# Altium schematic sheet iSensor.SchDoc
size A4
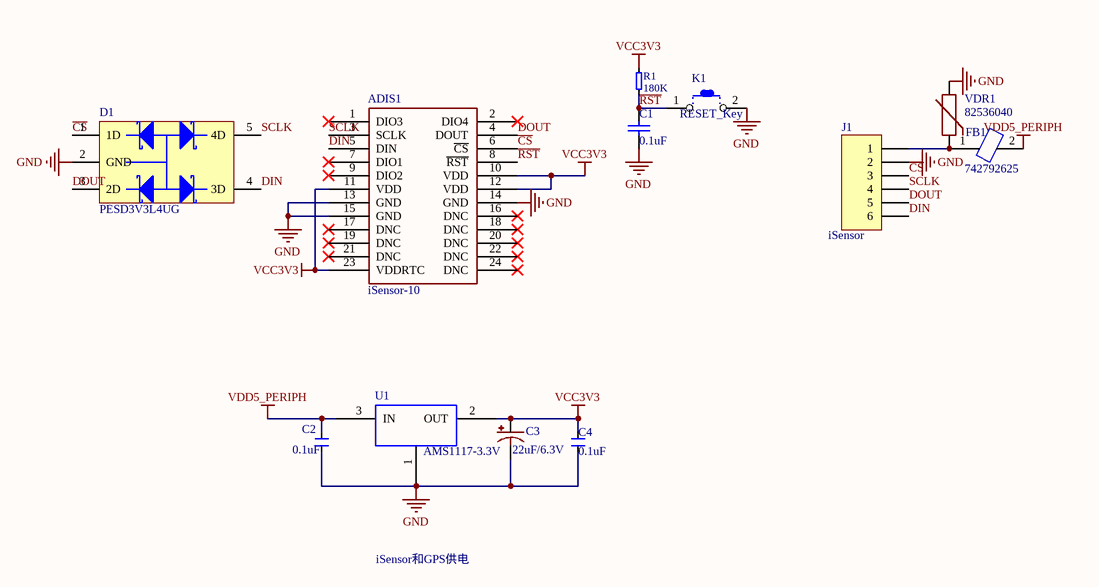
[diagram p0: iSensor.SchDoc]

## Parts
ADIS1  iSensor-10  [iSensor]
C1  0.1uF  [0603C]
C2  0.1uF  [0603C]
C3  22uF/6.3V  [3528/B]
C4  0.1uF  [0603C]
D1  PESD3V3L4UG  [SOT353]
FB1  742792625  [0603-FB]
J1  iSensor  [GH1.25-6]
K1  RESET_Key  [3*6*2.5 SMD]
R1  180K  [0603R]
U1  AMS1117-3.3V  [SOT223]
VDR1  82536040  [0603R]

## Nets
GND: ADIS1.13(GND) ADIS1.14(GND) ADIS1.15(GND) C1.1 C2.1 C3.2 C4.1 D1.2(GND) J1.2 K1.2 U1.1(COM) VDR1.1
VCC3V3: ADIS1.10(VDD) ADIS1.11(VDD) ADIS1.12(VDD) ADIS1.23(VDDRTC) C3.1 C4.2 R1.2 U1.2(OUT)
VDD5_PERIPH: C2.2 FB1.2 U1.3(IN)
~{CS}: ADIS1.6(~{CS}) D1.1(1D) J1.3
DIN: ADIS1.5(DIN) D1.4(3D) J1.6
DOUT: ADIS1.4(DOUT) D1.3(2D) J1.5
~{RST}: ADIS1.8(~{RST}) C1.2 K1.1 R1.1
SCLK: ADIS1.3(SCLK) D1.5(4D) J1.4
NetFB1_1: FB1.1 J1.1 VDR1.2

Not connected (* = marked no-connect by the designer): ADIS1 1(DIO3)* 2(DIO4)* 7(DIO1)* 9(DIO2)* 16(DNC)* 17(DNC)* 18(DNC)* 19(DNC)* 20(DNC)* 21(DNC)* 22(DNC)* 24(DNC)*

## Notes on the sheet
- iSensor和GPS供电

## Library data of the parts
C1 = Cap
C2 C4 = C
C3 = C-POLAR
FB1 = FB
J1 = HEAD1X6
R1 = R
U1 = AS1117M3-3.3V: 5V-3.3V
VDR1 = Varistor